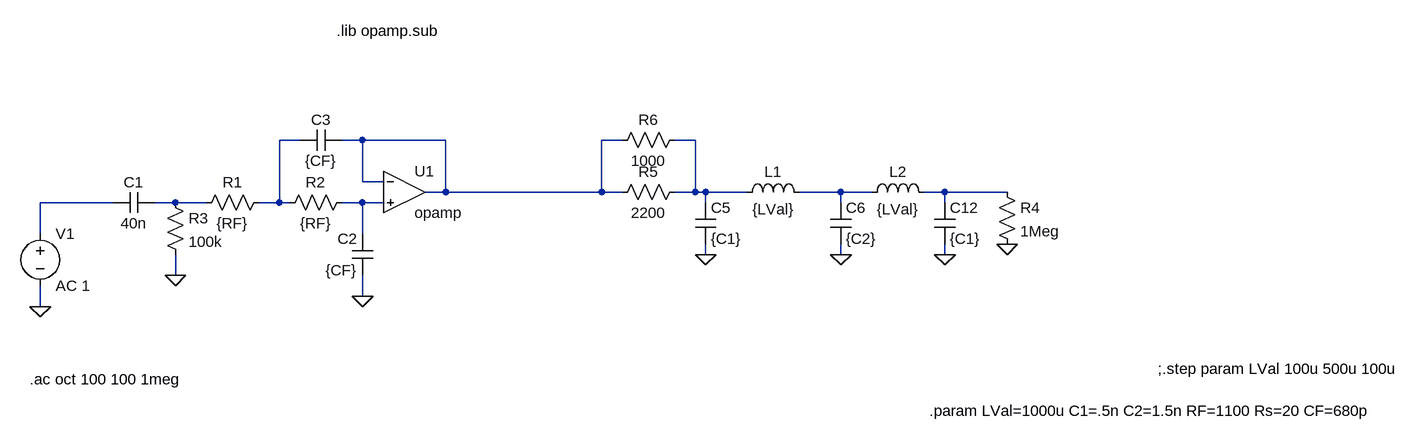
[diagram p0: schematic Anti-Alias_Filt.asc]
Anti-Alias_Filt.asc, the LTspice schematic file:
Version 4
SHEET 1 2980 680
WIRE 448 16 416 16
WIRE 544 16 512 16
WIRE 672 16 544 16
WIRE 944 16 912 16
WIRE 1056 16 1024 16
WIRE 544 80 544 16
WIRE 576 80 544 80
WIRE 672 96 672 16
WIRE 672 96 640 96
WIRE 912 96 912 16
WIRE 912 96 672 96
WIRE 944 96 912 96
WIRE 1056 96 1056 16
WIRE 1056 96 1024 96
WIRE 1072 96 1056 96
WIRE 1136 96 1072 96
WIRE 1280 96 1216 96
WIRE 1328 96 1280 96
WIRE 1440 96 1408 96
WIRE 1536 96 1440 96
WIRE 160 112 48 112
WIRE 256 112 224 112
WIRE 304 112 256 112
WIRE 416 112 416 16
WIRE 416 112 384 112
WIRE 432 112 416 112
WIRE 544 112 512 112
WIRE 576 112 544 112
WIRE 1072 112 1072 96
WIRE 1280 112 1280 96
WIRE 1440 112 1440 96
WIRE 48 160 48 112
WIRE 544 160 544 112
WIRE 1072 192 1072 176
WIRE 1280 192 1280 176
WIRE 1440 192 1440 176
WIRE 256 224 256 192
WIRE 544 256 544 224
WIRE 48 272 48 240
FLAG 48 272 0
FLAG 256 224 0
FLAG 544 256 0
FLAG 1440 192 0
FLAG 1280 192 0
FLAG 1072 192 0
FLAG 1536 176 0
SYMBOL voltage 48 144 R0
WINDOW 123 0 0 Left 0
WINDOW 39 0 0 Left 0
SYMATTR InstName V1
SYMATTR Value AC 1
SYMBOL cap 224 96 R90
WINDOW 0 0 32 VBottom 2
WINDOW 3 32 32 VTop 2
SYMATTR InstName C1
SYMATTR Value 40n
SYMBOL cap 560 224 R180
WINDOW 0 24 56 Left 2
WINDOW 3 24 8 Left 2
SYMATTR InstName C2
SYMATTR Value {CF}
SYMBOL cap 448 32 R270
WINDOW 0 32 32 VTop 2
WINDOW 3 0 32 VBottom 2
SYMATTR InstName C3
SYMATTR Value {CF}
SYMBOL res 400 96 R90
WINDOW 0 0 56 VBottom 2
WINDOW 3 32 56 VTop 2
SYMATTR InstName R1
SYMATTR Value {RF}
SYMBOL Opamps\\opamp 608 32 R0
SYMATTR InstName U1
SYMBOL res 240 96 R0
SYMATTR InstName R3
SYMATTR Value 100k
SYMBOL cap 1056 112 R0
SYMATTR InstName C5
SYMATTR Value {C1}
SYMBOL cap 1264 112 R0
SYMATTR InstName C6
SYMATTR Value {C2}
SYMBOL res 1040 80 R90
WINDOW 0 0 56 VBottom 2
WINDOW 3 32 56 VTop 2
SYMATTR InstName R5
SYMATTR Value 2200
SYMBOL ind 1120 112 R270
WINDOW 0 32 56 VTop 2
WINDOW 3 5 56 VBottom 2
SYMATTR InstName L1
SYMATTR Value {LVal}
SYMATTR SpiceLine Rser={Rs}
SYMBOL cap 1424 112 R0
SYMATTR InstName C12
SYMATTR Value {C1}
SYMBOL res 528 96 R90
WINDOW 0 0 56 VBottom 2
WINDOW 3 32 56 VTop 2
SYMATTR InstName R2
SYMATTR Value {RF}
SYMBOL ind 1312 112 R270
WINDOW 0 32 56 VTop 2
WINDOW 3 5 56 VBottom 2
SYMATTR InstName L2
SYMATTR Value {LVal}
SYMATTR SpiceLine Rser={Rs}
SYMBOL res 1520 80 R0
SYMATTR InstName R4
SYMATTR Value 1Meg
SYMBOL res 1040 0 R90
WINDOW 0 0 56 VBottom 2
WINDOW 3 32 56 VTop 2
SYMATTR InstName R6
SYMATTR Value 1000
TEXT 504 -152 Left 2 !.lib opamp.sub
TEXT 32 384 Left 2 !.ac oct 100 100 1meg
TEXT 1768 368 Left 2 !;.step param LVal 100u 500u 100u
TEXT 1416 432 Left 2 !.param LVal=1000u C1=.5n C2=1.5n RF=1100 Rs=20 CF=680p

The netlist it stands for:
* Anti-Alias_Filt.asc
V1 N006 0 AC 1
C1 N007 N006 40n
C2 0 N008 {CF}
C3 N001 N002 {CF}
R1 N001 N007 {RF}
XU1 N002 N008 N002 opamp Aol=100K GBW=10Meg  ; pins invin noninvin out
R3 N007 0 100k
C5 N003 0 {C1}
C6 N004 0 {C2}
R5 N003 N002 2200
L1 N003 N004 {LVal} Rser={Rs}
C12 N005 0 {C1}
R2 N008 N001 {RF}
L2 N004 N005 {LVal} Rser={Rs}
R4 N005 0 1Meg
R6 N003 N002 1000
.lib opamp.sub
.ac oct 100 100 1meg
;.step param LVal 100u 500u 100u
.param LVal=1000u C1=.5n C2=1.5n RF=1100 Rs=20 CF=680p
.backanno
.end